# EAGLE schematic Tiefenentladeschutz 2 (EAGLE 7.5.0)
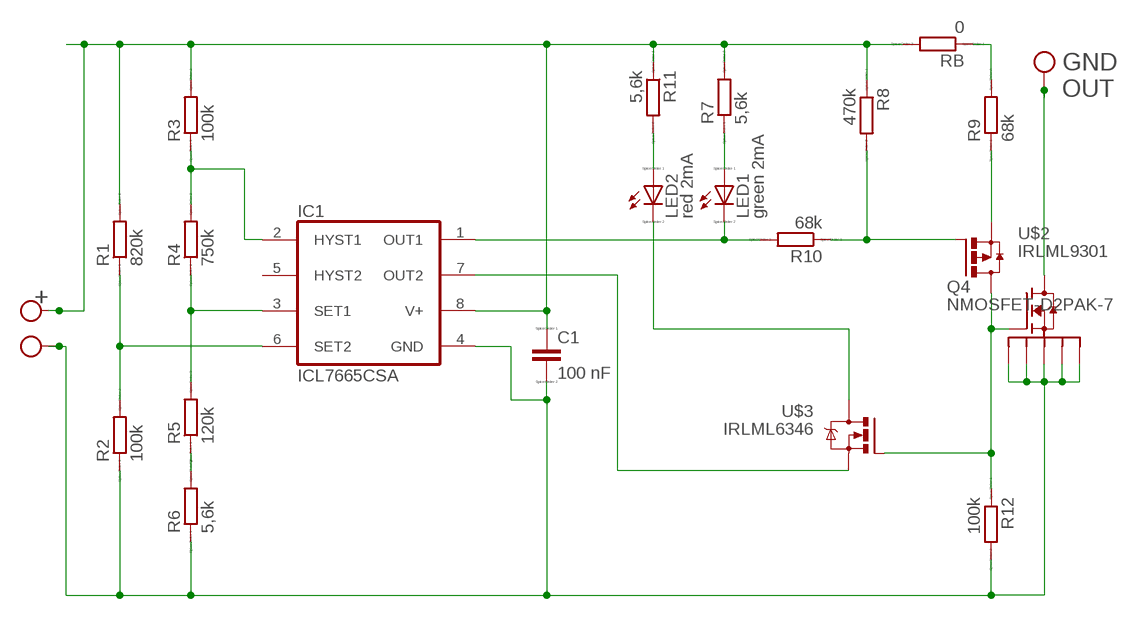
[diagram p0: schematic, sheet 1]

## Parts
C1  100 nF  CC1206  [C1206]
IC1  ICL7665CSA  [SO08]
LED1  green 2mA  LED_ESML0603  [LED_SML0603]
LED2  red 2mA  LED_ESML0603  [LED_SML0603]
Q4  NMOSFET-D2PAK-7  [H2PAK-6]
R1  820k  RR1206  [R1206]
R2  100k  RR1206  [R1206]
R3  100k  RR1206  [R1206]
R4  750k  RR1206  [R1206]
R5  120k  RR1206  [R1206]
R6  5,6k  RR1206  [R1206]
R7  5,6k  RR1206  [R1206]
R8  470k  RR1206  [R1206]
R9  68k  RR1206  [R1206]
R10  68k  RR1206  [R1206]
R11  5,6k  RR1206  [R1206]
R12  100k  RR1206  [R1206]
RB  0  RR1206  [R1206]
U$2  IRLML9301  [SOT-23]
U$3  IRLML6346  [SOT-23]
U$4  PINBIG  [PIN]
U$6  PIN1.27  [PIN-1.27]
U$7  PIN1.27  [PIN-1.27]

## Nets
GND: C1.2 IC1.4(GND) Q4.S1 Q4.S2 Q4.S3 Q4.S4 Q4.S5 R2.1 R6.1 R12.2 U$6.P$1
N$1: Q4.D U$7.P$1
N$2: IC1.3(SET1) R4.1 R5.2
N$3: IC1.7(OUT2) U$3.2(S)
N$4: IC1.6(SET2) R1.1 R2.2
N$5: LED2.A R11.2
N$6: LED1.A R7.1
N$7: R8.2 R10.1 U$2.3(G)
N$8: R9.1 U$2.2(S)
N$10: R9.2 RB.1
N$11: LED2.C U$3.1(D)
N$13: IC1.2(HYST1) R3.1 R4.2
N$16: IC1.1(OUT1) LED1.C R10.2
N$22: Q4.G R12.1 U$2.1(D) U$3.3(G)
N$26: R5.1 R6.2
V+: C1.1 IC1.8(V+) R1.2 R3.2 R7.2 R8.1 R11.1 RB.2 U$4.P$1
Unconnected: IC1.5(HYST2)

## Notes on the sheet
- GND 
  OUT
- +

## Library data of the parts
C1 = eagle-ltspice:C: CAPACITOR, European symbol; SPICEMODEL: NONE; SPICEPREFIX: C
IC1 = maxim:ICL7665CSA: UNDER/OVER VOLTAGE DETECTOR; MPN: ICL7665CSA+; OC_FARNELL: unknown; OC_NEWARK: 19M9537
LED1 LED2 = eagle-ltspice:LED_E: LED Source: http://www.osram.convergy.de Source: www.luxeon.com Source: www.kingbright.com; SPICEMODEL: NONE; SPICEPREFIX: D; SPICETYPE: diode
Q4 = D2pak-7:NMOSFET-D2PAK-7
R1-R12 RB = eagle-ltspice:R: RESISTOR, European symbol; SPICEMODEL: NONE; SPICEPREFIX: R
U$2 = 0liver:IRLML9301
U$3 = 0liver:IRLML6346
U$4 U$6 U$7 = 0liver:PIN